# EAGLE design DIDV_-_Baixa_Latencia_Conexão_Servos (EAGLE 6.2)

## Sheet 1 of 2
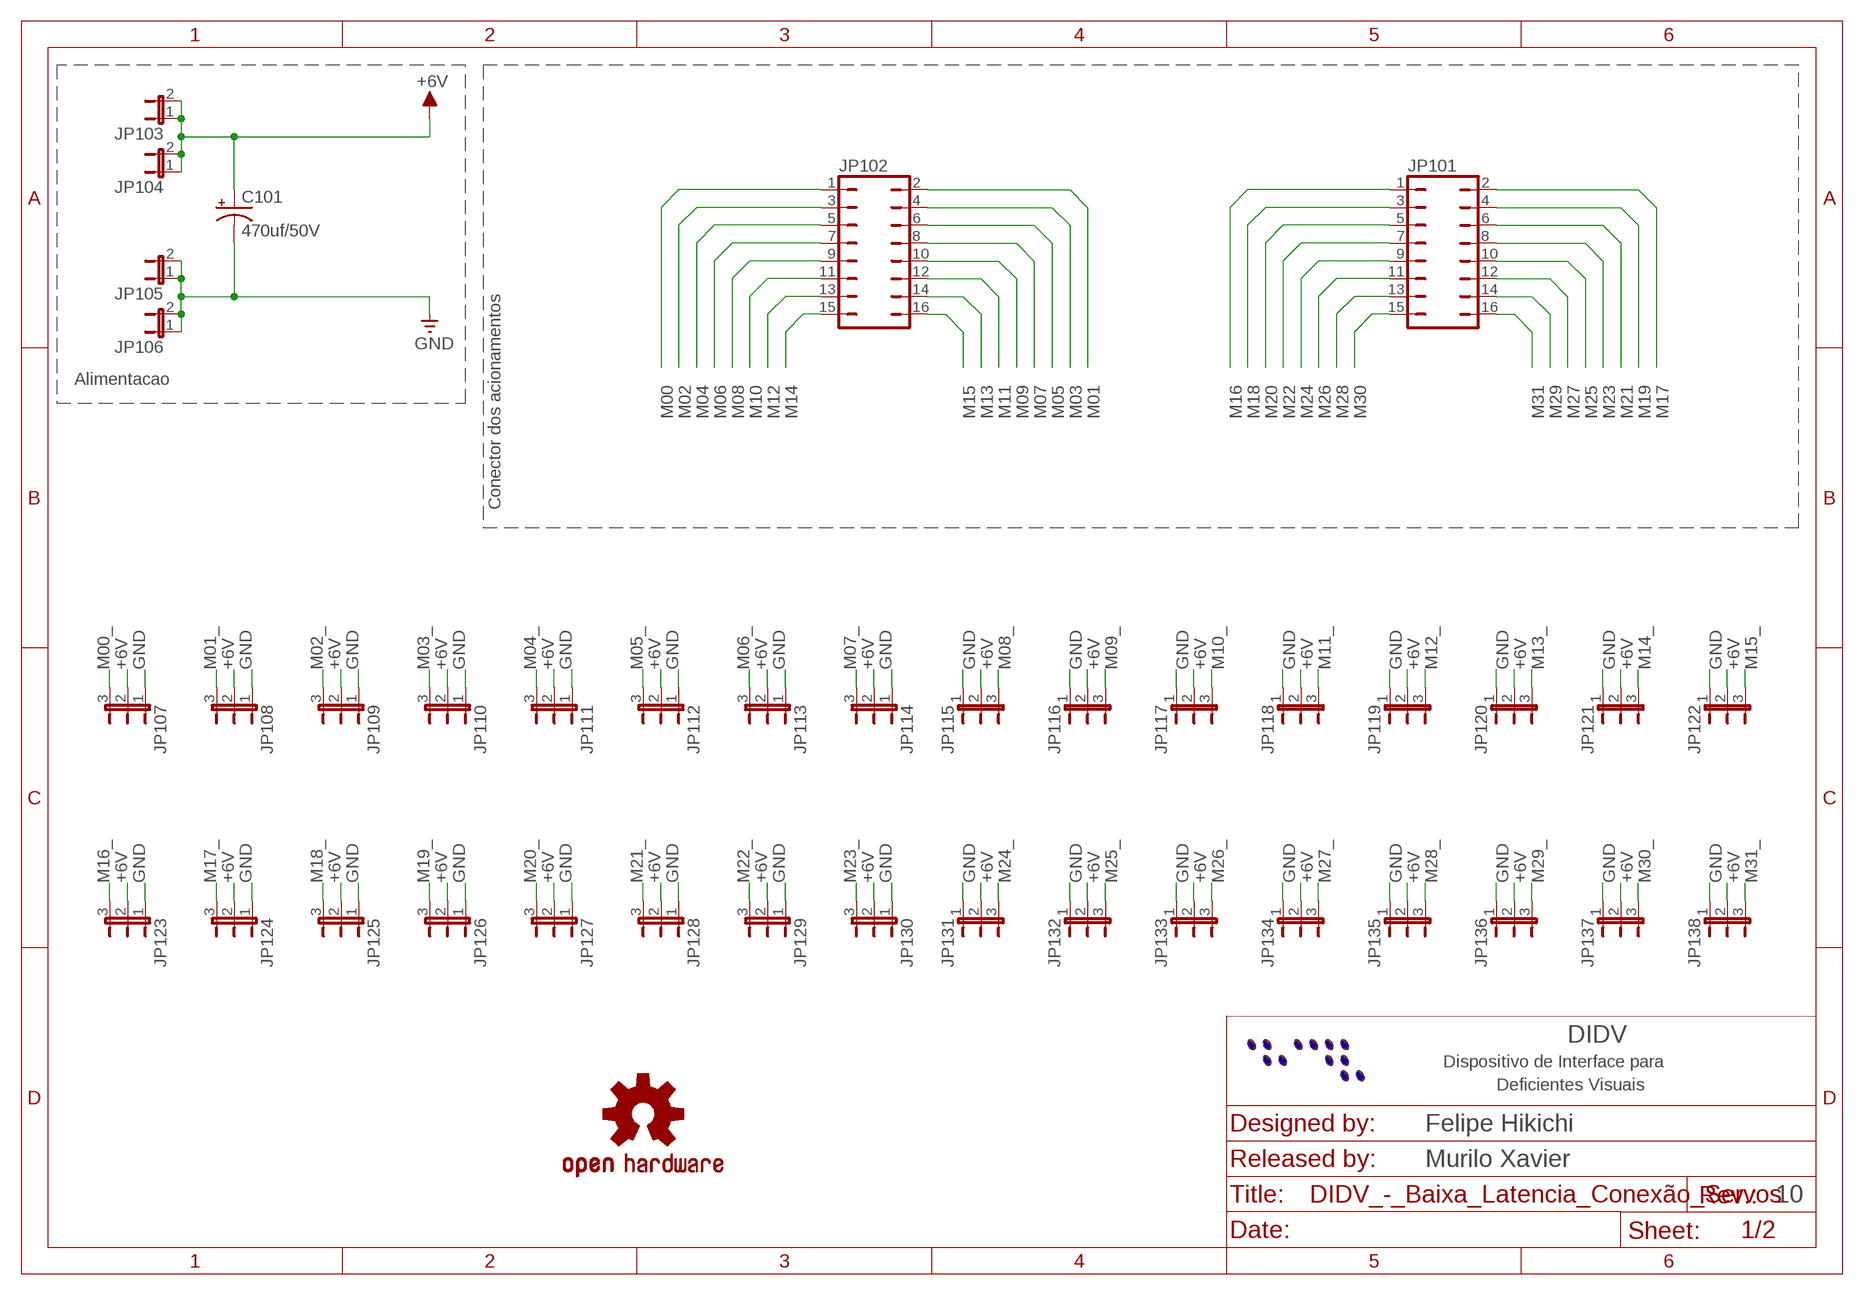
[diagram p0: schematic, sheet 1]

### Parts
C101  470uf/50V  CPOL-US140CLH-1010  [140CLH-1010]
JP101  JP8Q  [JP8Q]
JP102  JP8Q  [JP8Q]
JP103  JP1E  [JP1]
JP104  JP1E  [JP1]
JP105  JP1E  [JP1]
JP106  JP1E  [JP1]
JP107  JP2E  [JP2]
JP108  JP2E  [JP2]
JP109  JP2E  [JP2]
JP110  JP2E  [JP2]
JP111  JP2E  [JP2]
JP112  JP2E  [JP2]
JP113  JP2E  [JP2]
JP114  JP2E  [JP2]
JP115  JP2E  [JP2]
JP116  JP2E  [JP2]
JP117  JP2E  [JP2]
JP118  JP2E  [JP2]
JP119  JP2E  [JP2]
JP120  JP2E  [JP2]
JP121  JP2E  [JP2]
JP122  JP2E  [JP2]
JP123  JP2E  [JP2]
JP124  JP2E  [JP2]
JP125  JP2E  [JP2]
JP126  JP2E  [JP2]
JP127  JP2E  [JP2]
JP128  JP2E  [JP2]
JP129  JP2E  [JP2]
JP130  JP2E  [JP2]
JP131  JP2E  [JP2]
JP132  JP2E  [JP2]
JP133  JP2E  [JP2]
JP134  JP2E  [JP2]
JP135  JP2E  [JP2]
JP136  JP2E  [JP2]
JP137  JP2E  [JP2]
JP138  JP2E  [JP2]
LOGO101  OSHW-LOGOL  [OSHW-LOGO-L]

### Nets
+6V: C101.+ JP103.1 JP103.2 JP104.1 JP104.2 JP107.2 JP108.2 JP109.2 JP110.2 JP111.2 JP112.2 JP113.2 JP114.2 JP115.2 JP116.2 JP117.2 JP118.2 JP119.2 JP120.2 JP121.2 JP122.2 JP123.2 JP124.2 JP125.2 JP126.2 JP127.2 JP128.2 JP129.2 JP130.2 JP131.2 JP132.2 JP133.2 JP134.2 JP135.2 JP136.2 JP137.2 JP138.2
GND: C101.- JP105.1 JP105.2 JP106.1 JP106.2 JP107.1 JP108.1 JP109.1 JP110.1 JP111.1 JP112.1 JP113.1 JP114.1 JP115.1 JP116.1 JP117.1 JP118.1 JP119.1 JP120.1 JP121.1 JP122.1 JP123.1 JP124.1 JP125.1 JP126.1 JP127.1 JP128.1 JP129.1 JP130.1 JP131.1 JP132.1 JP133.1 JP134.1 JP135.1 JP136.1 JP137.1 JP138.1 ; also sheet 2
M00: JP102.1 ; also sheet 2
M00_: JP107.3 ; also sheet 2
M01: JP102.2 ; also sheet 2
M01_: JP108.3 ; also sheet 2
M02: JP102.3 ; also sheet 2
M02_: JP109.3 ; also sheet 2
M03: JP102.4 ; also sheet 2
M03_: JP110.3 ; also sheet 2
M04: JP102.5 ; also sheet 2
M04_: JP111.3 ; also sheet 2
M05: JP102.6 ; also sheet 2
M05_: JP112.3 ; also sheet 2
M06: JP102.7 ; also sheet 2
M06_: JP113.3 ; also sheet 2
M07: JP102.8 ; also sheet 2
M07_: JP114.3 ; also sheet 2
M08: JP102.9 ; also sheet 2
M08_: JP115.3 ; also sheet 2
M09: JP102.10 ; also sheet 2
M09_: JP116.3 ; also sheet 2
M10: JP102.11 ; also sheet 2
M10_: JP117.3 ; also sheet 2
M11: JP102.12 ; also sheet 2
M11_: JP118.3 ; also sheet 2
M12: JP102.13 ; also sheet 2
M12_: JP119.3 ; also sheet 2
M13: JP102.14 ; also sheet 2
M13_: JP120.3 ; also sheet 2
M14: JP102.15 ; also sheet 2
M14_: JP121.3 ; also sheet 2
M15: JP102.16 ; also sheet 2
M15_: JP122.3 ; also sheet 2
M16: JP101.1 ; also sheet 2
M16_: JP123.3 ; also sheet 2
M17: JP101.2 ; also sheet 2
M17_: JP124.3 ; also sheet 2
M18: JP101.3 ; also sheet 2
M18_: JP125.3 ; also sheet 2
M19: JP101.4 ; also sheet 2
M19_: JP126.3 ; also sheet 2
M20: JP101.5 ; also sheet 2
M20_: JP127.3 ; also sheet 2
M21: JP101.6 ; also sheet 2
M21_: JP128.3 ; also sheet 2
M22: JP101.7 ; also sheet 2
M22_: JP129.3 ; also sheet 2
M23: JP101.8 ; also sheet 2
M23_: JP130.3 ; also sheet 2
M24: JP101.9 ; also sheet 2
M24_: JP131.3 ; also sheet 2
M25: JP101.10 ; also sheet 2
M25_: JP132.3 ; also sheet 2
M26: JP101.11 ; also sheet 2
M26_: JP133.3 ; also sheet 2
M27: JP101.12 ; also sheet 2
M27_: JP134.3 ; also sheet 2
M28: JP101.13 ; also sheet 2
M28_: JP135.3 ; also sheet 2
M29: JP101.14 ; also sheet 2
M29_: JP136.3 ; also sheet 2
M30: JP101.15 ; also sheet 2
M30_: JP137.3 ; also sheet 2
M31: JP101.16 ; also sheet 2
M31_: JP138.3 ; also sheet 2

### Notes on the sheet
- Alimentacao
- Conector dos acionamentos
- DIDV
- Dispositivo de Interface para
- Deficientes Visuais
- Felipe Hikichi
- Murilo Xavier
- 10

## Sheet 2 of 2
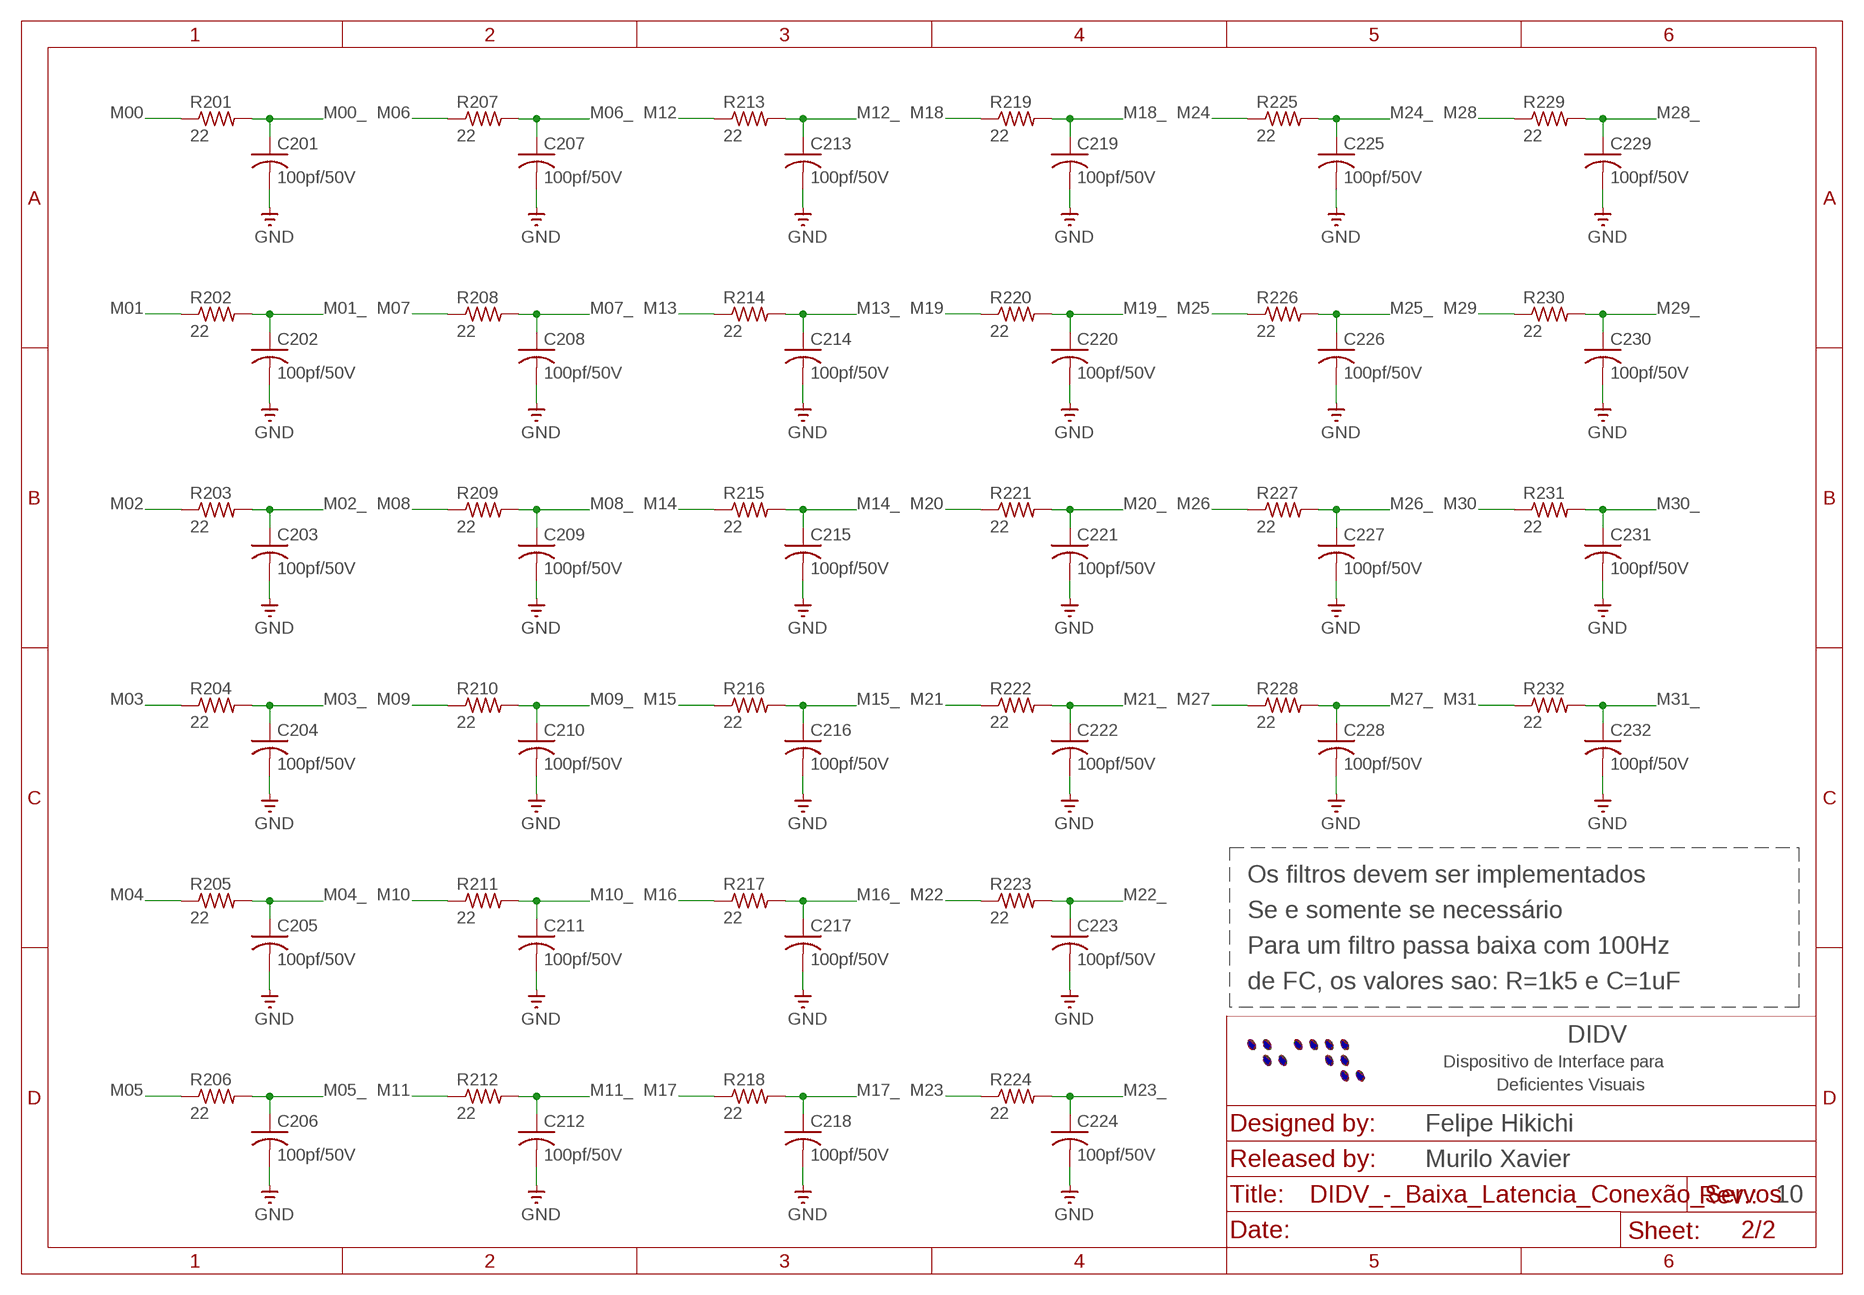
[diagram p1: schematic, sheet 2]

### Parts
C201  100pf/50V  C-USC0603  [C0603]
C202  100pf/50V  C-USC0603  [C0603]
C203  100pf/50V  C-USC0603  [C0603]
C204  100pf/50V  C-USC0603  [C0603]
C205  100pf/50V  C-USC0603  [C0603]
C206  100pf/50V  C-USC0603  [C0603]
C207  100pf/50V  C-USC0603  [C0603]
C208  100pf/50V  C-USC0603  [C0603]
C209  100pf/50V  C-USC0603  [C0603]
C210  100pf/50V  C-USC0603  [C0603]
C211  100pf/50V  C-USC0603  [C0603]
C212  100pf/50V  C-USC0603  [C0603]
C213  100pf/50V  C-USC0603  [C0603]
C214  100pf/50V  C-USC0603  [C0603]
C215  100pf/50V  C-USC0603  [C0603]
C216  100pf/50V  C-USC0603  [C0603]
C217  100pf/50V  C-USC0603  [C0603]
C218  100pf/50V  C-USC0603  [C0603]
C219  100pf/50V  C-USC0603  [C0603]
C220  100pf/50V  C-USC0603  [C0603]
C221  100pf/50V  C-USC0603  [C0603]
C222  100pf/50V  C-USC0603  [C0603]
C223  100pf/50V  C-USC0603  [C0603]
C224  100pf/50V  C-USC0603  [C0603]
C225  100pf/50V  C-USC0603  [C0603]
C226  100pf/50V  C-USC0603  [C0603]
C227  100pf/50V  C-USC0603  [C0603]
C228  100pf/50V  C-USC0603  [C0603]
C229  100pf/50V  C-USC0603  [C0603]
C230  100pf/50V  C-USC0603  [C0603]
C231  100pf/50V  C-USC0603  [C0603]
C232  100pf/50V  C-USC0603  [C0603]
R201  22  R-US_R0603  [R0603]
R202  22  R-US_R0603  [R0603]
R203  22  R-US_R0603  [R0603]
R204  22  R-US_R0603  [R0603]
R205  22  R-US_R0603  [R0603]
R206  22  R-US_R0603  [R0603]
R207  22  R-US_R0603  [R0603]
R208  22  R-US_R0603  [R0603]
R209  22  R-US_R0603  [R0603]
R210  22  R-US_R0603  [R0603]
R211  22  R-US_R0603  [R0603]
R212  22  R-US_R0603  [R0603]
R213  22  R-US_R0603  [R0603]
R214  22  R-US_R0603  [R0603]
R215  22  R-US_R0603  [R0603]
R216  22  R-US_R0603  [R0603]
R217  22  R-US_R0603  [R0603]
R218  22  R-US_R0603  [R0603]
R219  22  R-US_R0603  [R0603]
R220  22  R-US_R0603  [R0603]
R221  22  R-US_R0603  [R0603]
R222  22  R-US_R0603  [R0603]
R223  22  R-US_R0603  [R0603]
R224  22  R-US_R0603  [R0603]
R225  22  R-US_R0603  [R0603]
R226  22  R-US_R0603  [R0603]
R227  22  R-US_R0603  [R0603]
R228  22  R-US_R0603  [R0603]
R229  22  R-US_R0603  [R0603]
R230  22  R-US_R0603  [R0603]
R231  22  R-US_R0603  [R0603]
R232  22  R-US_R0603  [R0603]

### Nets
GND: C201.2 C202.2 C203.2 C204.2 C205.2 C206.2 C207.2 C208.2 C209.2 C210.2 C211.2 C212.2 C213.2 C214.2 C215.2 C216.2 C217.2 C218.2 C219.2 C220.2 C221.2 C222.2 C223.2 C224.2 C225.2 C226.2 C227.2 C228.2 C229.2 C230.2 C231.2 C232.2 ; also sheet 1
M00: R201.1 ; also sheet 1
M00_: C201.1 R201.2 ; also sheet 1
M01: R202.1 ; also sheet 1
M01_: C202.1 R202.2 ; also sheet 1
M02: R203.1 ; also sheet 1
M02_: C203.1 R203.2 ; also sheet 1
M03: R204.1 ; also sheet 1
M03_: C204.1 R204.2 ; also sheet 1
M04: R205.1 ; also sheet 1
M04_: C205.1 R205.2 ; also sheet 1
M05: R206.1 ; also sheet 1
M05_: C206.1 R206.2 ; also sheet 1
M06: R207.1 ; also sheet 1
M06_: C207.1 R207.2 ; also sheet 1
M07: R208.1 ; also sheet 1
M07_: C208.1 R208.2 ; also sheet 1
M08: R209.1 ; also sheet 1
M08_: C209.1 R209.2 ; also sheet 1
M09: R210.1 ; also sheet 1
M09_: C210.1 R210.2 ; also sheet 1
M10: R211.1 ; also sheet 1
M10_: C211.1 R211.2 ; also sheet 1
M11: R212.1 ; also sheet 1
M11_: C212.1 R212.2 ; also sheet 1
M12: R213.1 ; also sheet 1
M12_: C213.1 R213.2 ; also sheet 1
M13: R214.1 ; also sheet 1
M13_: C214.1 R214.2 ; also sheet 1
M14: R215.1 ; also sheet 1
M14_: C215.1 R215.2 ; also sheet 1
M15: R216.1 ; also sheet 1
M15_: C216.1 R216.2 ; also sheet 1
M16: R217.1 ; also sheet 1
M16_: C217.1 R217.2 ; also sheet 1
M17: R218.1 ; also sheet 1
M17_: C218.1 R218.2 ; also sheet 1
M18: R219.1 ; also sheet 1
M18_: C219.1 R219.2 ; also sheet 1
M19: R220.1 ; also sheet 1
M19_: C220.1 R220.2 ; also sheet 1
M20: R221.1 ; also sheet 1
M20_: C221.1 R221.2 ; also sheet 1
M21: R222.1 ; also sheet 1
M21_: C222.1 R222.2 ; also sheet 1
M22: R223.1 ; also sheet 1
M22_: C223.1 R223.2 ; also sheet 1
M23: R224.1 ; also sheet 1
M23_: C224.1 R224.2 ; also sheet 1
M24: R225.1 ; also sheet 1
M24_: C225.1 R225.2 ; also sheet 1
M25: R226.1 ; also sheet 1
M25_: C226.1 R226.2 ; also sheet 1
M26: R227.1 ; also sheet 1
M26_: C227.1 R227.2 ; also sheet 1
M27: R228.1 ; also sheet 1
M27_: C228.1 R228.2 ; also sheet 1
M28: R229.1 ; also sheet 1
M28_: C229.1 R229.2 ; also sheet 1
M29: R230.1 ; also sheet 1
M29_: C230.1 R230.2 ; also sheet 1
M30: R231.1 ; also sheet 1
M30_: C231.1 R231.2 ; also sheet 1
M31: R232.1 ; also sheet 1
M31_: C232.1 R232.2 ; also sheet 1

### Notes on the sheet
- Os filtros devem ser implementados
- Se e somente se necessário
- Para um filtro passa baixa com 100Hz
- de FC, os valores sao: R=1k5 e C=1uF
- DIDV
- Dispositivo de Interface para
- Deficientes Visuais
- Felipe Hikichi
- Murilo Xavier
- 10

## Library data of the parts
C101 = rcl:CPOL-US: POLARIZED CAPACITOR, American symbol
C201-C232 = rcl:C-US: CAPACITOR, American symbol
JP101 JP102 = jumper:JP8Q: JUMPER
JP103-JP106 = jumper:JP1E: JUMPER
JP107-JP138 = jumper:JP2E: JUMPER
LOGO101 = OpenHW_BOT:OSHW-LOGO: Open Source Hardware Logo This logo indicates the piece of hardware it is found on incorporates a OSHW license and/or adheres to the definition of open source hardware found here: http://freedomdefined.org/OSHW
R201-R232 = rcl:R-US_: RESISTOR, American symbol

## Board
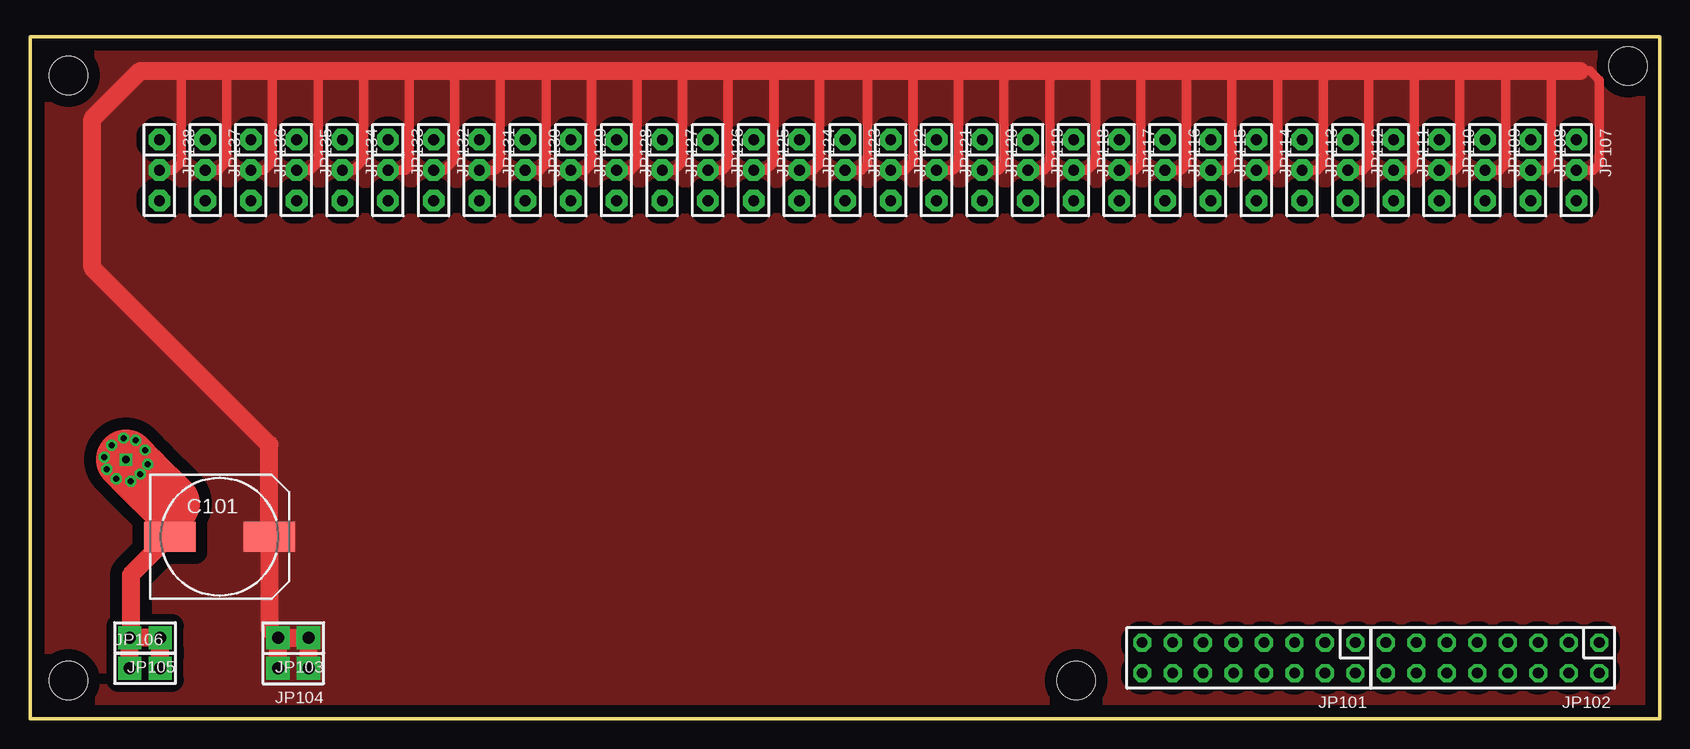
[diagram p2: board, top side]
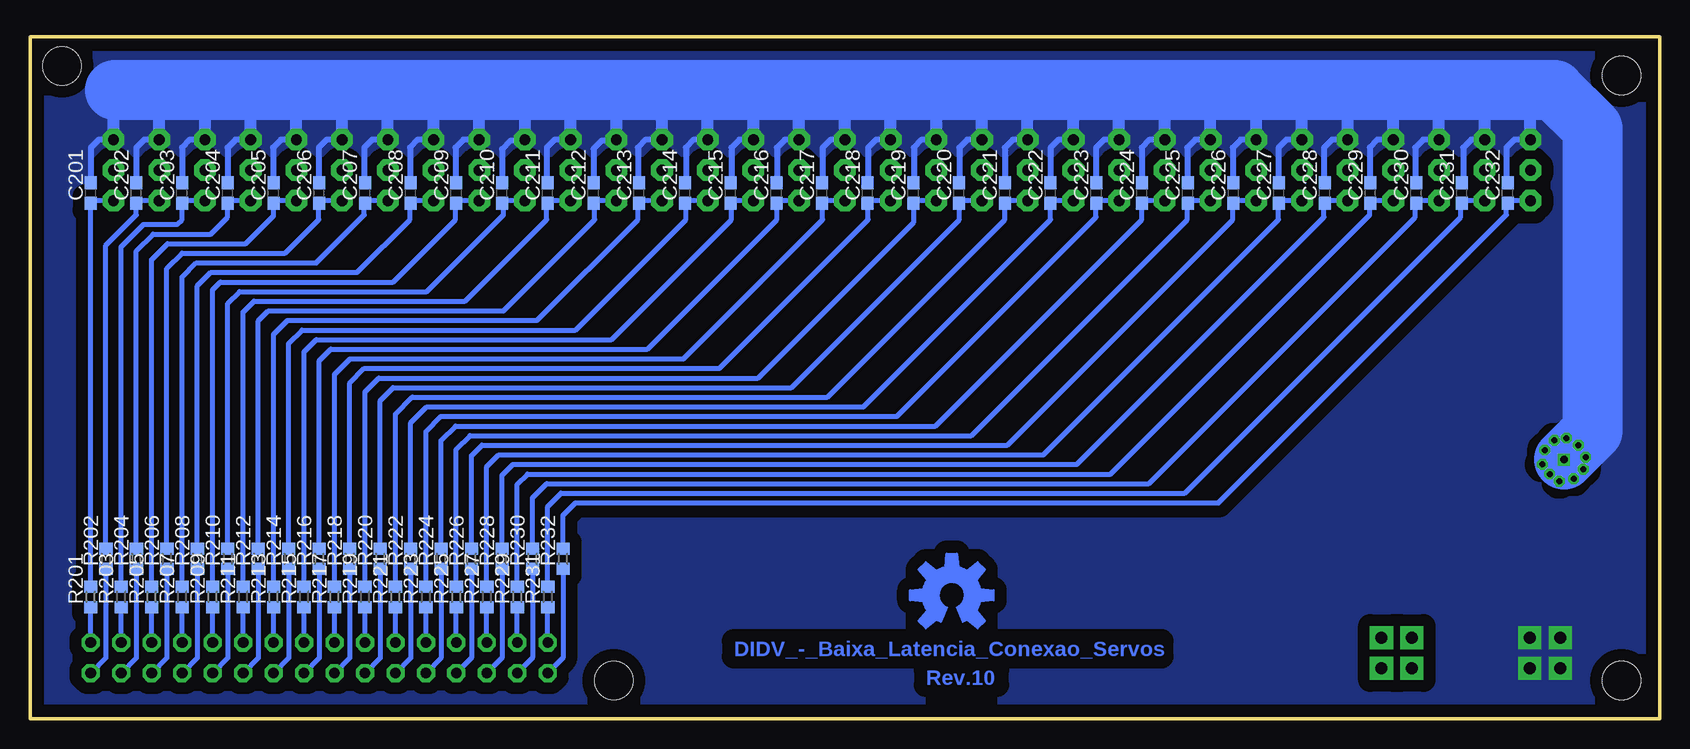
[diagram p3: board, bottom side, seen from below]

Size 135.87 x 56.82 mm. Coordinates in mm from the lower left corner, seen from the top.
Outline: 0,0 135.87,0 135.87,56.82 0,56.82 0,0
Copper layers (1*16): Top 0.035mm / dielectric 1.5mm / Bottom 0.035mm
Design rules: minimum track width 10mil, minimum drill 24mil, track to track 8mil, track to pad 8mil, pad to pad 8mil, via to via 8mil, smd to smd 8mil, copper to edge 40mil, drill to drill 8mil, minimum pad ring 10mil, minimum via ring 8mil, stop-mask expansion 4mil, vias tented up to drill 0mil, thermal gap 10mil
Holes 3.2 mm at 3.2,53.6 133.2,54.4 3.2,3.2 87.2,3.2

### Footprints (pad centres in the part's own frame; a part is rotated, then mirrored left to right if it is on the bottom)
140CLH-1010 = smd 4.3 x 2.5: + 4.15,0; - -4.15,0
C0603 = smd 1.1 x 1: 1 -0.85,0; 2 0.85,0
JP8Q = drill 0.9 pad 1.5 octagon: 1 -8.89,-1.27; 2 -8.89,1.27; 3 -6.35,-1.27; 4 -6.35,1.27; 5 -3.81,-1.27; 6 -3.81,1.27; 7 -1.27,-1.27; 8 -1.27,1.27; 9 1.27,-1.27; 10 1.27,1.27; 11 3.81,-1.27; 12 3.81,1.27; 13 6.35,-1.27; 14 6.35,1.27; 15 8.89,-1.27; 16 8.89,1.27
JP1 = drill 1 pad 1.93 square: 1 0,-1.27; 2 0,1.27
JP2 = drill 0.9 pad 1.8 octagon: 1 -2.54,0; 2 0,0; 3 2.54,0
R0603 = smd 1 x 1.1: 1 -0.85,0; 2 0.85,0

### Placement (x,y rotation side)
C101  15.8,15.17 0 top
C201  130.81,43.81 90 bottom
C202  127,43.81 90 bottom
C203  123.19,43.81 90 bottom
C204  119.38,43.81 90 bottom
C205  115.57,43.81 90 bottom
C206  111.76,43.81 90 bottom
C207  107.95,43.81 90 bottom
C208  104.14,43.81 90 bottom
C209  100.33,43.81 90 bottom
C210  96.52,43.81 90 bottom
C211  92.71,43.81 90 bottom
C212  88.9,43.81 90 bottom
C213  85.09,43.81 90 bottom
C214  81.28,43.81 90 bottom
C215  77.47,43.81 90 bottom
C216  73.66,43.81 90 bottom
C217  69.85,43.81 90 bottom
C218  66.04,43.81 90 bottom
C219  62.23,43.81 90 bottom
C220  58.42,43.81 90 bottom
C221  54.61,43.81 90 bottom
C222  50.8,43.81 90 bottom
C223  46.99,43.81 90 bottom
C224  43.18,43.81 90 bottom
C225  39.37,43.81 90 bottom
C226  35.56,43.81 90 bottom
C227  31.75,43.81 90 bottom
C228  27.94,43.81 90 bottom
C229  24.13,43.81 90 bottom
C230  20.32,43.81 90 bottom
C231  16.51,43.81 90 bottom
C232  12.7,43.81 90 bottom
JP101  101.6,5.08 180 top
JP102  121.92,5.08 180 top
JP103  21.94,6.75 90 top
JP104  21.94,4.21 90 top
JP105  9.59,6.75 90 top
JP106  9.59,4.21 270 top
JP107  128.91,45.72 270 top
JP108  125.09,45.72 270 top
JP109  121.28,45.72 270 top
JP110  117.47,45.72 270 top
JP111  113.67,45.72 270 top
JP112  109.86,45.72 270 top
JP113  106.05,45.72 270 top
JP114  102.23,45.72 270 top
JP115  98.42,45.72 270 top
JP116  94.61,45.72 270 top
JP117  90.81,45.72 270 top
JP118  87,45.72 270 top
JP119  83.19,45.72 270 top
JP120  79.38,45.72 270 top
JP121  75.56,45.72 270 top
JP122  71.75,45.72 270 top
JP123  67.94,45.72 270 top
JP124  64.14,45.72 270 top
JP125  60.33,45.72 270 top
JP126  56.52,45.72 270 top
JP127  52.7,45.72 270 top
JP128  48.9,45.72 270 top
JP129  45.09,45.72 270 top
JP130  41.27,45.72 270 top
JP131  37.47,45.72 270 top
JP132  33.66,45.72 270 top
JP133  29.84,45.72 270 top
JP134  26.04,45.72 270 top
JP135  22.23,45.72 270 top
JP136  18.41,45.72 270 top
JP137  14.61,45.72 270 top
JP138  10.79,45.72 270 top
LOGO101  59.03,10.3 0 top
R201  130.81,10.16 90 bottom
R202  129.54,13.34 90 bottom
R203  128.27,10.16 90 bottom
R204  127,13.34 90 bottom
R205  125.73,10.16 90 bottom
R206  124.46,13.34 90 bottom
R207  123.19,10.16 90 bottom
R208  121.92,13.34 90 bottom
R209  120.65,10.16 90 bottom
R210  119.38,13.34 90 bottom
R211  118.11,10.16 90 bottom
R212  116.84,13.34 90 bottom
R213  115.57,10.16 90 bottom
R214  114.3,13.34 90 bottom
R215  113.03,10.16 90 bottom
R216  111.76,13.34 90 bottom
R217  110.49,10.16 90 bottom
R218  109.22,13.34 90 bottom
R219  107.95,10.16 90 bottom
R220  106.68,13.34 90 bottom
R221  105.41,10.16 90 bottom
R222  104.14,13.34 90 bottom
R223  102.87,10.16 90 bottom
R224  101.6,13.34 90 bottom
R225  100.33,10.16 90 bottom
R226  99.06,13.34 90 bottom
R227  97.79,10.16 90 bottom
R228  96.52,13.34 90 bottom
R229  95.25,10.16 90 bottom
R230  93.98,13.34 90 bottom
R231  92.71,10.16 90 bottom
R232  91.44,13.34 90 bottom

### Tracks (layer width: path | path; a pad name or v marks a point on that pad's centre or on a via)
+6V
  Top 0.8: JP138.2 11.92,45.72 12.6,46.4 12.6,53.8 12.4,54 | JP137.2 15.72,45.72 16.4,46.4 16.4,54 | JP136.2 19.52,45.72 20.2,46.4 20.2,53.8 20.4,54 | JP135.2 23.32,45.72 24,46.4 24,54 | JP134.2 26.92,45.72 27.8,46.6 27.8,53.8 27.6,54 | JP133.2 31.32,45.72 31.6,46 31.6,53.6 32,54 | JP132.2 34.52,45.72 35.4,46.6 35.4,53.8 35.2,54 | JP131.2 38.72,45.72 39.2,46.2 39.2,54 | JP130.2 42.52,45.72 43,46.2 43,53.8 42.8,54 | JP129.2 46.32,45.72 46.8,46.2 46.8,54 | JP128.2 50.12,45.72 50.6,46.2 50.6,53.8 50.4,54 | JP127.2 53.72,45.72 54.4,46.4 54.4,54 | JP126.2 57.72,45.72 58.2,46.2 58.2,53.8 58,54 | JP125.2 61.32,45.72 62,46.4 62,53.6 62.4,54 | JP124.2 65.32,45.72 65.8,46.2 65.8,53.4 66.4,54 | JP123.2 69.32,45.72 69.8,46.2 69.8,53.8 69.6,54 | JP122.2 72.92,45.72 73.6,46.4 73.6,54 | JP121.2 76.92,45.72 77.4,46.2 77.4,53.8 77.6,54 | JP120.2 80.72,45.72 81.2,46.2 81.2,53.6 80.8,54 | JP119.2 84.52,45.72 85,46.2 85,53.8 84.8,54 | JP118.2 88.12,45.72 88.8,46.4 88.8,54 | JP117.2 92.12,45.72 92.6,46.2 92.6,53.8 92.8,54 | JP116.2 95.92,45.72 96.4,46.2 96.4,54 | JP115.2 99.72,45.72 100.2,46.2 100.2,53.8 100,54 | JP114.2 103.52,45.72 104,46.2 104,54 | JP113.2 107.32,45.72 107.8,46.2 107.8,53.8 108,54 | JP112.2 111.12,45.72 111.6,46.2 111.6,54 | JP111.2 114.92,45.72 115.4,46.2 115.4,53.8 115.6,54 | JP110.2 118.72,45.72 119.2,46.2 119.2,53.6 119.6,54 | JP109.2 122.52,45.72 123,46.2 123,53.8 123.2,54 | JP108.2 126.32,45.72 126.8,46.2 126.8,54 | JP107.2 130.32,45.72 130.8,46.2 130.8,53.2 130,54 129.2,54
  Top 1.5: JP104.2 JP103.2 | JP103.2 JP103.1 JP104.1 | JP103.2 19.95,7.47 C101.+ 19.95,22.85 5.2,37.6 5.2,50 9.2,54 12.4,54 16.4,54 20.4,54 24,54 27.6,54 32,54 35.2,54 39.2,54 42.8,54 46.8,54 50.4,54 54.4,54 58,54 62.4,54 66.4,54 69.6,54 73.6,54 77.6,54 80.8,54 84.8,54 88.8,54 92.8,54 96.4,54 100,54 104,54 108,54 111.6,54 115.6,54 119.6,54 123.2,54 126.8,54 129.2,54
  pour Top (isolate 1, no thermals): 0,56.8 136,56.8 136,0 0,0
GND  (via drill 0.5 pad 0.81, 0.6)
  Top 0.406: C101.- 11.65,17.95
  Top 1.5: C101.- 11.57,15.17 8.4,12 8.4,6.83 JP105.2 | JP106.2 JP105.1 JP105.2 | JP106.1 JP105.2
  Top 5: 11.65,17.95 v9.2,20.4 v8,21.6
  Bottom 0.4: 130.8,44.8 130.8,44.67 | 66,44.8 66,44.7 | 119.4,44.8 119.4,44.69 | 94.67,48.2 JP116.1 | 87.06,48.2 JP118.1 | 73.6,44.8 73.6,44.73 | 43.2,44.8 43.2,44.69 | 31.8,44.8 31.8,44.72 | 28,44.8 28,44.73 | 24.2,44.8 24.2,44.73 | 20.4,44.8 20.4,44.74
  Bottom 0.5: JP107.1 130.14,48.26 130.8,47.6 130.8,44.8 130.81,44.79 C201.2 | JP123.1 69.14,48.26 69.8,47.6 69.8,44.72 C217.2 | JP108.1 126.34,48.26 127,47.6 C202.2 | JP124.1 65.34,48.26 66,47.6 66,44.8 66.04,44.76 C218.2 | JP109.1 122.54,48.26 123.2,47.6 123.2,44.67 C203.2 | JP125.1 61.54,48.26 62.2,47.6 62.2,44.7 C219.2 | JP110.1 118.74,48.26 119.4,47.6 119.4,44.8 119.38,44.78 C204.2 | JP111.1 114.94,48.26 115.6,47.6 115.6,44.7 C205.2 | JP112.1 111.14,48.26 111.8,47.6 111.8,44.7 C206.2 | JP113.1 107.34,48.26 108,47.6 108,44.72 C207.2 | JP114.1 103.54,48.26 104.2,47.6 104.2,44.73 C208.2 | JP115.1 99.74,48.26 100.4,47.6 100.4,44.73 C209.2 | 94.67,48.2 95.8,48.2 96.52,47.48 C210.2 | JP117.1 92.14,48.26 92.8,47.6 92.8,44.76 C211.2 | 87.06,48.2 88.2,48.2 88.9,47.5 C212.2 | JP119.1 84.54,48.26 85.2,47.6 85.2,44.77 C213.2 | JP120.1 80.54,48.26 81.2,47.6 81.2,44.74 C214.2 | JP121.1 76.74,48.26 77.4,47.6 77.4,44.73 C215.2 | JP122.1 72.94,48.26 73.6,47.6 73.6,44.8 73.66,44.74 C216.2 | JP126.1 57.74,48.26 58.4,47.6 58.4,44.69 C220.2 | JP127.1 53.94,48.26 54.6,47.6 54.6,44.67 C221.2 | JP128.1 50.14,48.26 50.8,47.6 C222.2 | JP129.1 46.34,48.26 47,47.6 47,44.67 C223.2 | JP130.1 42.54,48.26 43.2,47.6 43.2,44.8 43.18,44.78 C224.2 | JP131.1 38.74,48.26 39.4,47.6 39.4,44.7 C225.2 | JP132.1 34.94,48.26 35.6,47.6 35.6,44.7 C226.2 | JP133.1 31.14,48.26 31.8,47.6 31.8,44.8 31.75,44.75 C227.2 | JP134.1 27.34,48.26 28,47.6 28,44.8 27.94,44.74 C228.2 | JP135.1 23.54,48.26 24.2,47.6 24.2,44.8 24.13,44.73 C229.2 | JP136.1 19.74,48.26 20.4,47.6 20.4,44.8 20.32,44.72 C230.2 | JP137.1 15.74,48.26 16.4,47.6 16.4,44.77 C231.2
  Bottom 0.5: JP138.1 12.14,48.26 12.8,47.6 12.8,44.77 C232.2
  Bottom 1: JP107.1 128.91,52.3 128.8,52.4 | JP108.1 125.09,51.3 124.8,51.6 124.8,52.4 | JP109.1 121.28,51.91 120.8,52.4 | JP110.1 117.47,51.48 117.6,51.6 117.6,52 117.2,52.4 | JP111.1 113.67,51.66 114,52 114,52.4 | JP112.1 109.86,52.66 110,52.8 110,52.4 | JP113.1 106.05,52.05 106.4,52.4 | JP114.1 102.23,52.16 102,52.4 | JP115.1 98.42,52.38 98.4,52.4 | JP116.1 94.61,52.19 94.4,52.4 | JP117.1 90.81,52.4 90.8,52.4 | JP118.1 87,52.2 86.8,52.4 | JP119.1 83.19,52.38 83.2,52.4 | JP120.1 79.38,52.23 79.2,52.4 | JP121.1 75.56,52.03 75.2,52.4 | JP122.1 71.75,52.24 71.6,52.4 | JP123.1 67.94,52.74 68,52.8 68.4,52.4 | JP124.1 64.14,52.27 64,52.4 | JP125.1 60.33,52.33 60.4,52.4 | JP126.1 56.52,52.12 56.8,52.4 | JP127.1 52.7,52.7 52.8,52.8 52.4,52.8 52.8,52.4 | JP128.1 48.9,52.3 48.8,52.4 | JP129.1 45.09,51.72 44.4,52.4 | JP130.1 41.27,53.12 41.2,53.2 41.2,52.4 | JP131.1 37.47,52.66 37.6,52.8 37.6,52.4 | JP132.1 33.66,52.34 33.6,52.4 | JP133.1 29.84,52.65 30,52.8 30,52.4 | JP134.1 26.04,52.03 26.4,52.4 | JP135.1 22.23,51.83 22.8,52.4 | JP136.1 18.41,52.02 18.8,52.4 | JP137.1 14.61,51.41 15.6,52.4 | JP138.1 10.79,52.4 10.8,52.4
  Bottom 5: v8,21.6 v6.8,22.8 5.6,24 5.6,49.2 8.8,52.4 10.8,52.4 15.6,52.4 18.8,52.4 22.8,52.4 26.4,52.4 30,52.4 33.6,52.4 37.6,52.4 41.2,52.4 44.4,52.4 48.8,52.4 52.8,52.4 56.8,52.4 60.4,52.4 64,52.4 68.4,52.4 71.6,52.4 75.2,52.4 79.2,52.4 83.2,52.4 86.8,52.4 90.8,52.4 94.4,52.4 98.4,52.4 102,52.4 106.4,52.4 110,52.4 114,52.4 117.2,52.4 120.8,52.4 124.8,52.4 128.8,52.4
  pour Bottom (isolate 1, no thermals): 136,56.8 136,0 0,0 0,56.8
M00
  Bottom 0.4: JP102.1 R201.1
M00_
  Bottom 0.4: R201.2 C201.1 130.59,43.18 JP107.3
M01
  Bottom 0.4: R202.1 129.54,5.08 JP102.2
M01_
  Bottom 0.4: R202.2 129.54,39.46 127,42 C202.1 126.78,43.18 JP108.3
M02
  Bottom 0.4: JP102.3 R203.1
M02_
  Bottom 0.4: R203.2 128.27,39.33 126.4,41.2 123.6,41.2 123.2,41.6 C203.1 122.97,43.18 JP109.3
M03
  Bottom 0.4: R204.1 127,5.08 JP102.4
M03_
  Bottom 0.4: JP110.3 119.17,43.18 C204.1 119.4,42.95 119.4,41.8 120.8,40.4 125.6,40.4 127,39 R204.2
M04
  Bottom 0.4: JP102.5 R205.1
M04_
  Bottom 0.4: JP111.3 115.36,43.18 C205.1 115.57,41.91 117.88,39.6 124.4,39.6 125.73,38.27 R205.2
M05
  Bottom 0.4: R206.1 124.46,5.08 JP102.6
M05_
  Bottom 0.4: JP112.3 111.55,43.18 C206.1 111.8,42.92 111.8,41.6 114.6,38.8 123.2,38.8 124.46,37.54 R206.2
M06
  Bottom 0.4: JP102.7 R207.1
M06_
  Bottom 0.4: R207.2 123.19,36.81 122,38 112,38 108,42 108,42.91 C207.1 107.73,43.18 JP113.3
M07
  Bottom 0.4: R208.1 121.92,5.08 JP102.8
M07_
  Bottom 0.4: R208.2 121.92,36.08 120.8,37.2 108.6,37.2 104.2,41.6 104.2,42.91 C208.1 103.92,43.18 JP114.3
M08
  Bottom 0.4: JP102.9 R209.1
M08_
  Bottom 0.4: R209.2 120.65,35.75 120,36.4 105.6,36.4 100.4,41.6 100.4,42.9 C209.1 100.11,43.18 JP115.3
M09
  Bottom 0.4: R210.1 119.38,5.08 JP102.10
M09_
  Bottom 0.4: JP116.3 96.31,43.18 C210.1 96.4,42.84 96.4,42 102.8,35.6 118.4,35.6 119.38,34.62 R210.2
M10
  Bottom 0.4: JP102.11 R211.1
M10_
  Bottom 0.4: JP117.3 92.5,43.18 C211.1 92.8,42.88 92.8,41.6 99,35.4 99.6,34.8 117.2,34.8 118.11,33.89 R211.2
M11
  Bottom 0.4: R212.1 116.84,5.08 JP102.12
M11_
  Bottom 0.4: R212.2 116.84,33.16 116,34 96.4,34 88.8,41.6 88.8,42.87 C212.1 88.69,43.18 JP118.3
M12
  Bottom 0.4: JP102.13 R213.1
M12_
  Bottom 0.4: R213.2 115.57,32.03 114.4,33.2 93.6,33.2 85.2,41.6 85.2,42.85 C213.1 84.88,43.18 JP119.3
M13
  Bottom 0.4: R214.1 114.3,5.08 JP102.14
M13_
  Bottom 0.4: R214.2 114.3,31.3 113.2,32.4 90.4,32.4 81.2,41.6 81.2,42.88 C214.1 81.06,43.18 JP120.3
M14
  Bottom 0.4: JP102.15 R215.1
M14_
  Bottom 0.4: R215.2 113.03,30.57 112,31.6 87.4,31.6 77.4,41.6 77.4,42.9 C215.1 77.25,43.18 JP121.3
M15
  Bottom 0.4: R216.1 111.76,5.08 JP102.16
M15_
  Bottom 0.4: R216.2 111.76,29.84 110.8,30.8 84.4,30.8 73.6,41.6 73.6,42.91 C216.1 73.44,43.18 JP122.3
M16
  Bottom 0.4: JP101.1 R217.1
M16_
  Bottom 0.4: R217.2 110.49,28.71 109.2,30 81.4,30 69.8,41.6 69.8,42.91 C217.1 69.64,43.18 JP123.3
M17
  Bottom 0.4: R218.1 109.22,5.08 JP101.2
M17_
  Bottom 0.4: R218.2 109.22,27.98 108,29.2 78.4,29.2 66,41.6 66,42.92 C218.1 65.83,43.18 JP124.3
M18
  Bottom 0.4: JP101.3 R219.1
M18_
  Bottom 0.4: R219.2 107.95,27.25 106.8,28.4 75.2,28.4 62.2,41.4 62.2,42.94 C219.1 62.02,43.18 JP125.3
M19
  Bottom 0.4: R220.1 106.68,5.08 JP101.4
M19_
  Bottom 0.4: R220.2 106.68,26.52 105.6,27.6 72.4,27.6 58.4,41.6 58.4,42.95 C220.1 58.2,43.18 JP126.3
M20
  Bottom 0.4: JP101.5 R221.1
M20_
  Bottom 0.4: R221.2 105.41,25.39 104,26.8 69.4,26.8 54.6,41.6 C221.1 54.4,43.18 JP127.3
M21
  Bottom 0.4: R222.1 104.14,5.08 JP101.6
M21_
  Bottom 0.4: R222.2 104.14,24.66 102.8,26 66.4,26 50.8,41.6 C222.1 50.59,43.18 JP128.3
M22
  Bottom 0.4: JP101.7 R223.1
M22_
  Bottom 0.4: R223.2 102.87,23.93 101.6,25.2 63.6,25.2 47,41.8 C223.1 46.77,43.18 JP129.3
M23
  Bottom 0.4: R224.1 101.6,5.08 JP101.8
M23_
  Bottom 0.4: R224.2 101.6,23.2 100.4,24.4 60.4,24.4 43.2,41.6 43.2,42.95 C224.1 42.97,43.18 JP130.3
M24
  Bottom 0.4: JP101.9 R225.1
M24_
  Bottom 0.4: R225.2 100.33,22.47 99.2,23.6 57.4,23.6 39.4,41.6 39.4,42.94 C225.1 39.16,43.18 JP131.3
M25
  Bottom 0.4: R226.1 99.06,5.08 JP101.10
M25_
  Bottom 0.4: R226.2 99.06,21.94 98.2,22.8 54.4,22.8 35.6,41.6 35.6,42.92 C226.1 35.34,43.18 JP132.3
M26
  Bottom 0.4: JP101.11 R227.1
M26_
  Bottom 0.4: R227.2 97.79,21.01 96.8,22 51.4,22 31.8,41.6 31.8,42.91 C227.1 31.54,43.18 JP133.3
M27
  Bottom 0.4: R228.1 96.52,5.08 JP101.12
M27_
  Bottom 0.4: R228.2 96.52,20.28 95.6,21.2 48.6,21.2 28,41.8 28,42.91 C228.1 27.73,43.18 JP134.3
M28
  Bottom 0.4: JP101.13 R229.1
M28_
  Bottom 0.4: R229.2 95.25,19.55 94.4,20.4 45.8,20.4 24.2,42 24.2,42.9 C229.1 23.91,43.18 JP135.3
M29
  Bottom 0.4: R230.1 93.98,5.08 JP101.14
M29_
  Bottom 0.4: R230.2 93.98,18.42 92.8,19.6 42.6,19.6 20.4,41.8 20.4,42.88 C230.1 20.11,43.18 JP136.3
M30
  Bottom 0.4: JP101.15 R231.1
M30_
  Bottom 0.4: R231.2 92.71,17.69 91.6,18.8 39.6,18.8 16.6,41.8 16.6,42.88 C231.1 16.3,43.18 JP137.3
M31
  Bottom 0.4: R232.1 91.44,5.08 JP101.16
M31_
  Bottom 0.4: R232.2 91.44,16.96 90.4,18 36.8,18 12.8,42 12.8,42.87 C232.1 12.48,43.18 JP138.3
N$1  (via drill 0.5 pad 0.81)
  other vias: 9.8,21.2
N$2  (via drill 0.5 pad 0.81)
  other vias: 8.4,19.8
N$3  (via drill 0.5 pad 0.81)
  other vias: 8.8,23.2
N$4  (via drill 0.5 pad 0.81)
  other vias: 6.4,20.8
N$5  (via drill 0.5 pad 0.81)
  other vias: 9.6,22.4
N$6  (via drill 0.5 pad 0.81)
  other vias: 7.2,20
N$7  (via drill 0.5 pad 0.81)
  other vias: 7.8,23.4
N$8  (via drill 0.5 pad 0.81)
  other vias: 6.2,21.8

### Text on the board
Bottom: DIDV_-_Baixa_Latencia_Conexao_Servos | Rev.10